# EAGLE design ipod-female-breakout (EAGLE 7.5.0)
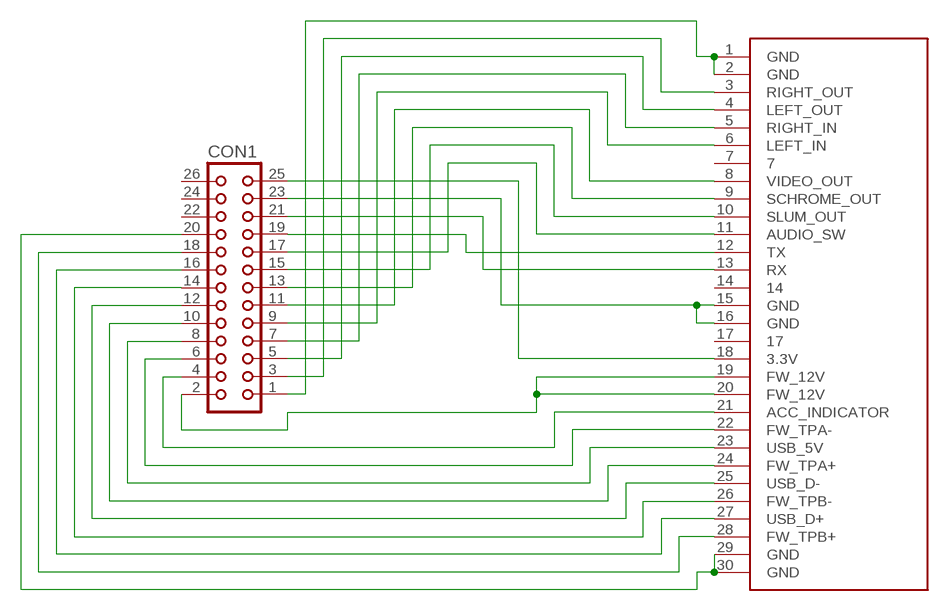
[diagram p0: schematic, sheet 1]

## Parts
CON1  CON26  [CON26]
U$1  IPOD_CONNECTOR_FEMALE  [IPOD_FEMALE_CONNECTOR]

## Nets
3.3V: CON1.25 U$1.18(3.3V)
ACC_INDICATOR: CON1.4 U$1.21(ACC_INDICATOR)
AGND: CON1.1 U$1.1(GND) U$1.2(GND)
AUDIO_SW: CON1.17 U$1.11(AUDIO_SW)
FW_12V: CON1.2 U$1.19(FW_12V) U$1.20(FW_12V)
FW_GND: CON1.23 U$1.15(GND) U$1.16(GND)
FW_TPA+: CON1.10 U$1.24(FW_TPA+)
FW_TPA-: CON1.6 U$1.22(FW_TPA-)
FW_TPB+: CON1.18 U$1.28(FW_TPB+)
FW_TPB-: CON1.14 U$1.26(FW_TPB-)
GND: CON1.20 U$1.29(GND) U$1.30(GND)
LEFT_IN: CON1.9 U$1.6(LEFT_IN)
LEFT_OUT: CON1.5 U$1.4(LEFT_OUT)
RIGHT_IN: CON1.7 U$1.5(RIGHT_IN)
RIGHT_OUT: CON1.3 U$1.3(RIGHT_OUT)
RX: CON1.21 U$1.13(RX)
SCHROME_OUT: CON1.13 U$1.9(SCHROME_OUT)
SLUM_OUT: CON1.15 U$1.10(SLUM_OUT)
TX: CON1.19 U$1.12(TX)
USB_5V: CON1.8 U$1.23(USB_5V)
USB_D+: CON1.16 U$1.27(USB_D+)
USB_D-: CON1.12 U$1.25(USB_D-)
VIDEO_OUT: CON1.11 U$1.8(VIDEO_OUT)
Unconnected: CON1.22 CON1.24 CON1.26 U$1.7 U$1.14 U$1.17

## Library data of the parts
CON1 = con-harting:CON26: CONNECTOR; OC_FARNELL: unknown; OC_NEWARK: unknown
U$1 = SparkFun-Connectors:IPOD_CONNECTOR_FEMALE: iPod Female Connector This is the connector found inside current iPods. Use this connector to attach to iPod accessories like Nike+iPods, etc. Schematic and footprint are not yet production proven. Spark Fun Electronics SKU : DEV-08035

## Board
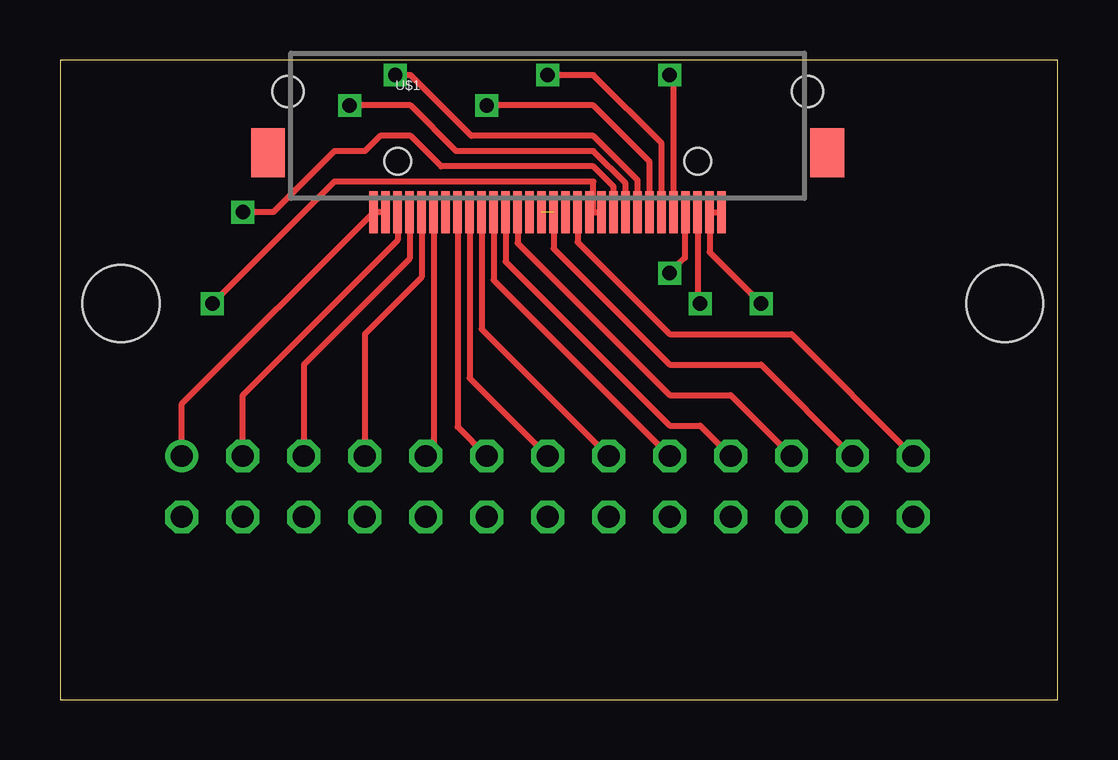
[diagram p1: board, top side]
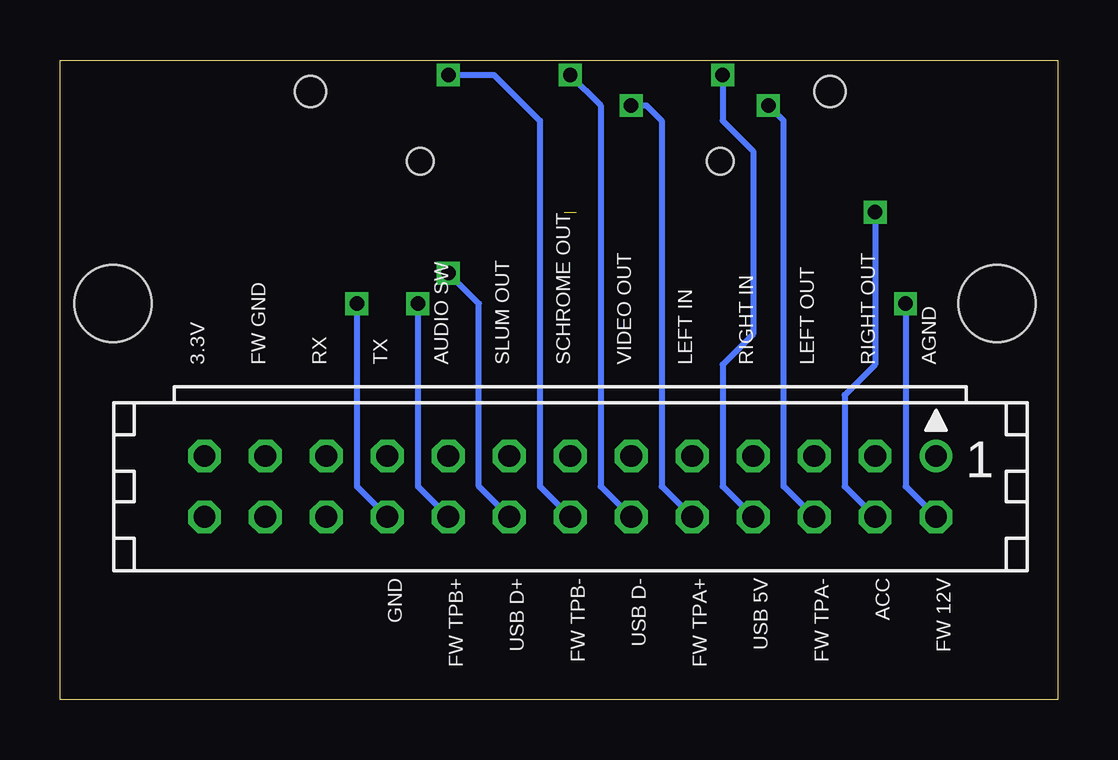
[diagram p2: board, bottom side, seen from below]

Size 41.58 x 26.66 mm. Coordinates in mm from the lower left corner, seen from the top.
Outline: 0,0 41.58,0 41.58,26.66 0,26.66 0,0
Copper layers (1*16): Top 0.0356mm / dielectric 1.5011mm / Bottom 0.0356mm
Design rules "LaenPCBOrder": minimum track width 6mil, minimum drill 13mil, track to track 6mil, track to pad 6mil, pad to pad 6mil, via to via 6mil, smd to smd 6mil, copper to edge 15mil, drill to drill 6mil, minimum pad ring 7mil, minimum via ring 7mil, stop-mask expansion 3mil, vias tented up to drill 0mil, thermal gap 10mil
Holes 3.2 mm at 2.54,16.51 39.37,16.51

### Footprints (pad centres in the part's own frame; a part is rotated, then mirrored left to right if it is on the bottom)
CON26 = drill 0.914: 1 -15.24,-1.27 | drill 0.914 octagon: 2 -15.24,1.27; 3 -12.7,-1.27; 4 -12.7,1.27; 5 -10.16,-1.27; 6 -10.16,1.27; 7 -7.62,-1.27; 8 -7.62,1.27; 9 -5.08,-1.27; 10 -5.08,1.27; 11 -2.54,-1.27; 12 -2.54,1.27; 13 0,-1.27; 14 0,1.27; 15 2.54,-1.27; 16 2.54,1.27; 17 5.08,-1.27; 18 5.08,1.27; 19 7.62,-1.27; 20 7.62,1.27; 21 10.16,-1.27; 22 10.16,1.27; 23 12.7,-1.27; 24 12.7,1.27; 25 15.24,-1.27; 26 15.24,1.27
IPOD_FEMALE_CONNECTOR = smd 0.35 x 1.75: 1 -7.25,0; 2 -6.75,0; 3 -6.25,0; 4 -5.75,0; 5 -5.25,0; 6 -4.75,0; 7 -4.25,0; 8 -3.75,0; 9 -3.25,0; 10 -2.75,0; 11 -2.25,0; 12 -1.75,0; 13 -1.25,0; 14 -0.75,0; 15 -0.25,0; 16 0.25,0; 17 0.75,0; 18 1.25,0; 19 1.75,0; 20 2.25,0; 21 2.75,0; 22 3.25,0; 23 3.75,0; 24 4.25,0; 25 4.75,0; 26 5.25,0; 27 5.75,0; 28 6.25,0; 29 6.75,0; 30 7.25,0 | smd 1.4 x 2.05: 31 -11.65,2.475; 32 11.65,2.475 | hole 1.1: 6.25,2.125; -6.25,2.125 | hole 1.3: 10.825,5.025; -10.825,5.025

### Placement (x,y rotation side)
CON1  20.32,8.89 180 bottom
U$1  20.32,20.32 0 top

### Tracks (layer width: path | path; a pad name or v marks a point on that pad's centre or on a via)
3.3V
  Top 0.254: U$1.18 21.57,19.07 25.4,15.24 30.48,15.24 CON1.25
ACC_INDICATOR  (via drill 0.6)
  Top 0.254: U$1.21 23.07,21.38 22.23,22.23 15.88,22.23 14.61,23.5 13.34,23.5 12.7,22.86 11.43,22.86 8.89,20.32 v7.62,20.32
  Bottom 0.254: v7.62,20.32 7.62,13.97 8.89,12.7 8.89,8.89 CON1.4
AGND
  Top 0.254: CON1.1 5.08,12.33 U$1.1 U$1.2
AUDIO_SW
  Top 0.254: U$1.11 18.07,17.49 CON1.17
FW_12V  (via drill 0.6)
  Top 0.254: v6.35,16.51 11.43,21.59 22.23,21.59 22.23,20.32 U$1.19 U$1.20
  Bottom 0.254: v6.35,16.51 6.35,8.89 CON1.2
FW_GND  (1 unrouted)
  Top 0.254: U$1.16 20.57,18.8 25.4,13.97 29.21,13.97 CON1.23
FW_TPA+  (via drill 0.6)
  Top 0.254: U$1.24 24.57,22.42 22.23,24.77 v17.78,24.77
  Bottom 0.254: CON1.10 16.51,8.89 16.51,24.13 17.14,24.77 v17.78,24.77
FW_TPA-  (via drill 0.6)
  Top 0.254: U$1.22 23.57,21.52 22.23,22.86 16.51,22.86 14.61,24.77 v12.06,24.77
  Bottom 0.254: CON1.6 11.43,8.89 11.43,24.13 v12.06,24.77
FW_TPB+  (via drill 0.6)
  Top 0.254: U$1.28 26.57,16.61 v26.67,16.51
  Bottom 0.254: v26.67,16.51 26.67,8.89 CON1.18
FW_TPB-  (via drill 0.6)
  Top 0.254: U$1.26 25.57,25.86 v25.4,26.04
  Bottom 0.254: CON1.14 21.59,8.89 21.59,24.13 23.5,26.04 v25.4,26.04
GND  (via drill 0.6)
  Top 0.254: v29.21,16.51 27.07,18.65 U$1.29 U$1.30
  Bottom 0.254: v29.21,16.51 29.21,8.89 CON1.20
LEFT_IN
  Top 0.254: U$1.6 15.57,10.49 CON1.9
LEFT_OUT
  Top 0.254: U$1.4 14.57,18.38 10.16,13.97 CON1.5
RIGHT_IN
  Top 0.254: U$1.5 15.07,17.61 12.7,15.24 CON1.7
RIGHT_OUT
  Top 0.254: CON1.3 7.62,12.7 14.07,19.15 U$1.3
RX
  Top 0.254: U$1.13 19.07,19.03 25.4,12.7 27.94,12.7 CON1.21
SCHROME_OUT
  Top 0.254: U$1.9 17.07,13.41 CON1.13
SLUM_OUT
  Top 0.254: U$1.10 17.57,15.45 CON1.15
TX
  Top 0.254: U$1.12 18.57,18.26 25.4,11.43 26.67,11.43 CON1.19
USB_5V  (via drill 0.6)
  Top 0.254: U$1.23 24.07,21.65 22.23,23.5 17.14,23.5 14.61,26.04 v13.97,26.04
  Bottom 0.254: CON1.8 13.97,8.89 13.97,13.97 12.7,15.24 12.7,22.86 13.97,24.13 v13.97,26.04
USB_D+  (via drill 0.6)
  Top 0.254: U$1.27 26.04,20.29 26.04,18.41 v25.4,17.78
  Bottom 0.254: CON1.16 24.13,8.89 24.13,16.51 v25.4,17.78
USB_D-  (via drill 0.6)
  Top 0.254: U$1.25 25.07,23.19 22.23,26.04 v20.32,26.04
  Bottom 0.254: CON1.12 19.05,8.89 19.05,24.77 v20.32,26.04
VIDEO_OUT
  Top 0.254: U$1.8 16.57,11.37 CON1.11

### Text on the board
bPlace: AGND | RIGHT OUT | LEFT OUT | RIGHT IN | LEFT IN | VIDEO OUT | SCHROME OUT | SLUM OUT | AUDIO SW | TX | RX | FW GND | 3.3V | FW 12V | ACC | FW TPA- | USB 5V | FW TPA+ | USB D- | FW TPB- | USB D+ | FW TPB+ | GND